# EAGLE design Expansion board rev1 (EAGLE 7.6.0)
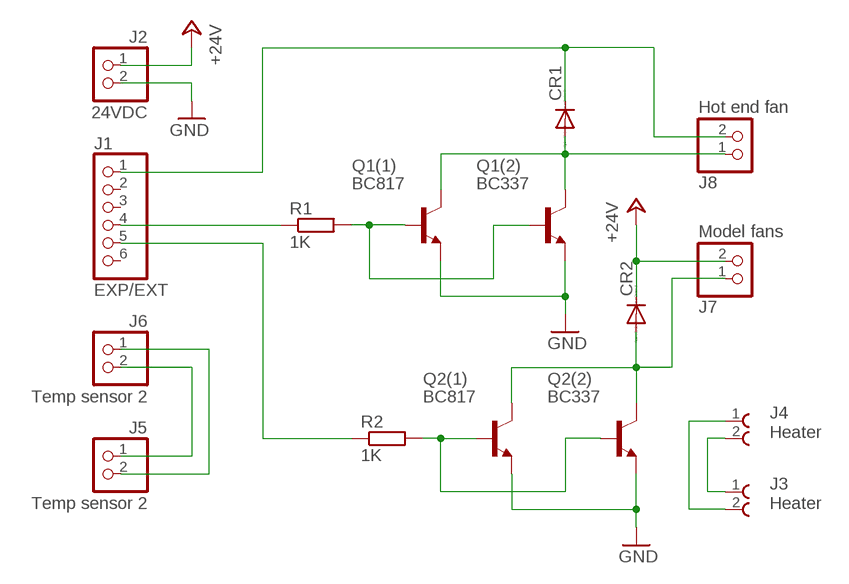
[diagram p0: schematic, sheet 1]

## Parts
CR1  TESTDIODE  [DO214AC]
CR2  TESTDIODE  [DO214AC]
J1  EXP/EXT  PINHD-2X3  [2X03]
J2  24VDC  PINHD-1X2  [1X02]
J3  Heater  691216710002  [691216710002]
J4  Heater  691216710002  [691216710002]
J5  Temp sensor 2  PINHD-1X2  [1X02]
J6  Temp sensor 2  PINHD-1X2  [1X02]
J7  Model fans  PINHD-1X2  [1X02]
J8  Hot end fan  S2B-XH-A  [JST_XH_2_RA]
Q1(1)  BC817  BC817-40SMD  [SOT23-BEC]
Q1(2)  BC337  BC337-40  [TO92]
Q2(1)  BC817  BC817-40SMD  [SOT23-BEC]
Q2(2)  BC337  BC337-40  [TO92]
R1  1K  R-EU_M3216  [M3216]
R2  1K  R-EU_M3216  [M3216]

## Nets
+24V: CR2.C J2.1 J7.2
GND: J2.2 Q1(1).E Q1(2).1(E) Q2(1).E Q2(2).1(E)
N$1: CR2.A J7.1 Q2(1).C Q2(2).3(C)
N$2: J3.2 J4.1
N$3: CR1.A J8.1 Q1(1).C Q1(2).3(C)
N$4: J3.1 J4.2
N$5: Q2(1).B Q2(2).2(B) R2.2
N$6: Q1(1).B Q1(2).2(B) R1.2
N$7: CR1.C J1.1 J8.2
N$8: J1.5 R2.1
N$9: J1.4 R1.1
N$20: J5.1 J6.2
N$21: J5.2 J6.1
Unconnected: J1.2 J1.3 J1.6

## Library data of the parts
CR1 CR2 = [ME] Semiconductors:TESTDIODE
J1 = [ME] Connectors:PINHD-2X3: PIN HEADER
J2 J5-J7 = pinhead:PINHD-1X2: PIN HEADER
J3 J4 = Wurth_EAGLE-TERMINAL_BLOCKS-rev16e:691216710002: WR-TBL2 SERIE 2167 - 5.00 MM - HORIZONTAL CABLE ENTRY WITH RISING CAGE CLAMP - 2 pins <http://katalog.we-online.de/media/images/eican/Con_TBL_Screw_RisingClamp_5.00_6912167100xx_pf2.jpg> Details see: http://katalog.we-online.de/en/em/TBL_5_00_2167_HORIZONTAL_ENTRY_W_RISING_CAGE_69121671000x Created on 2015-07-10 2015 (C) Wurth Elektronik
J8 = [ME] Connectors:S2B-XH-A
Q1(1) Q2(1) = transistor-npn:BC817*: NPN Transistor
Q1(2) Q2(2) = transistor-npn:BC337*: NPN Transistor
R1 R2 = resistor:R-EU_: RESISTOR, European symbol

## Board
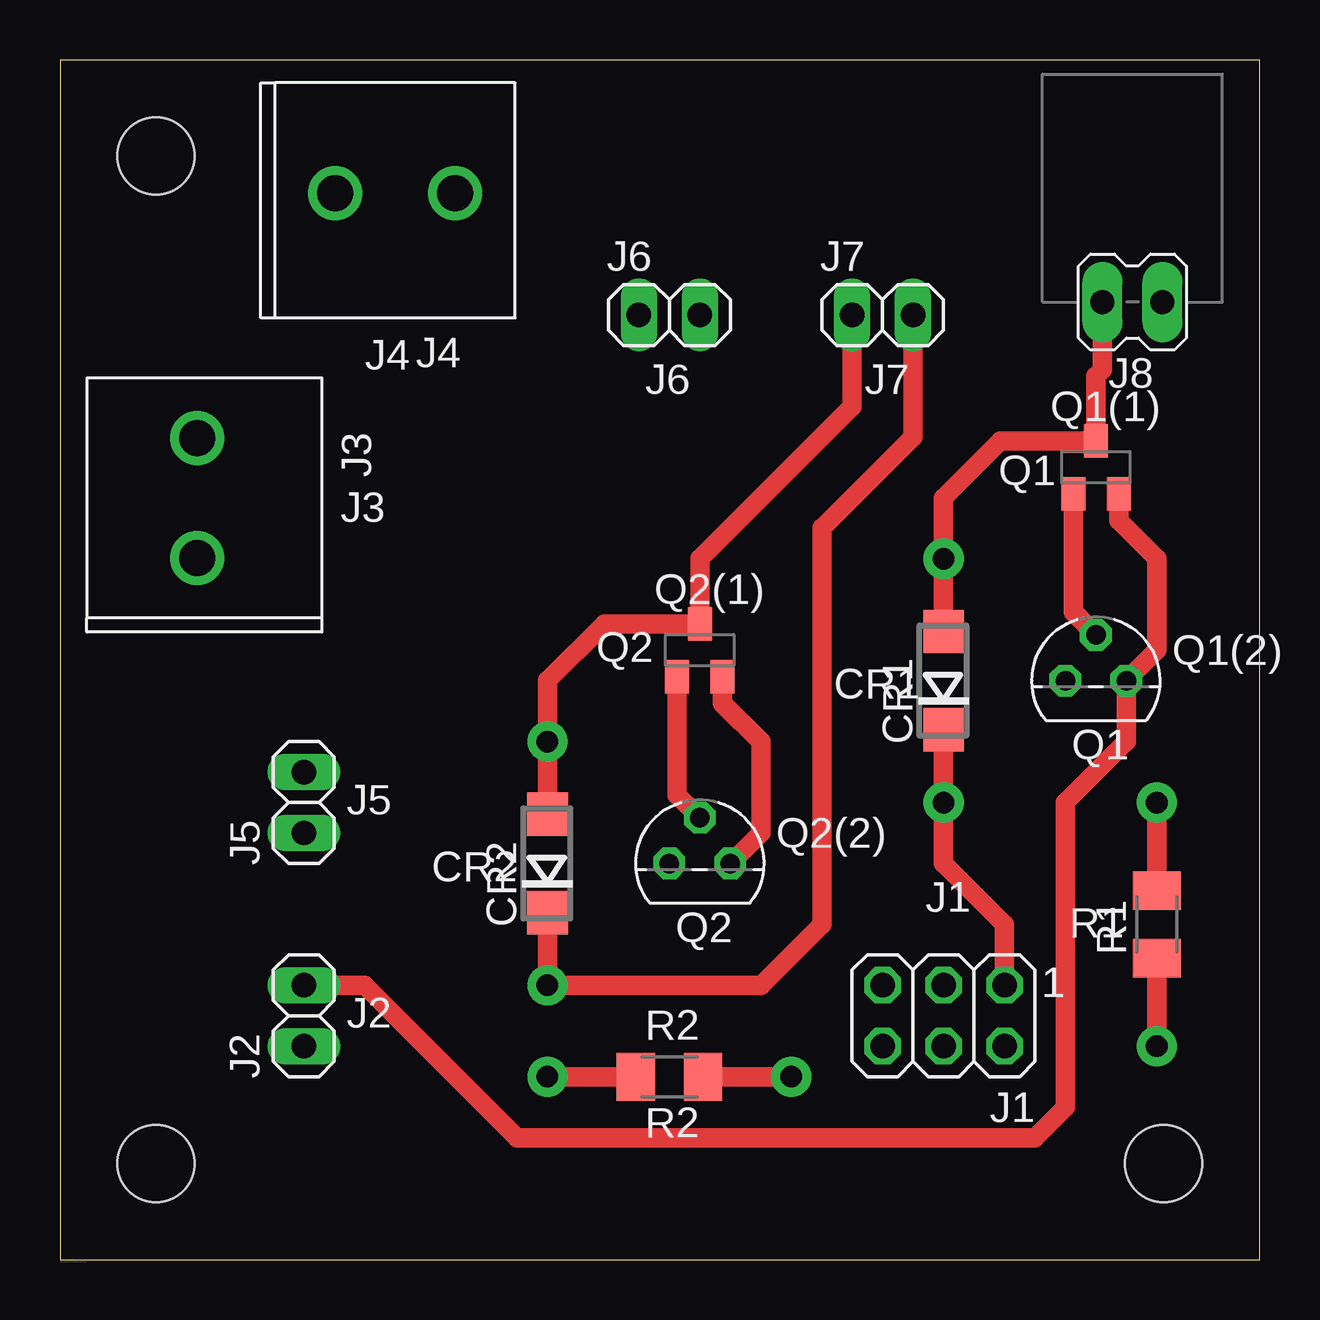
[diagram p1: board, top side]
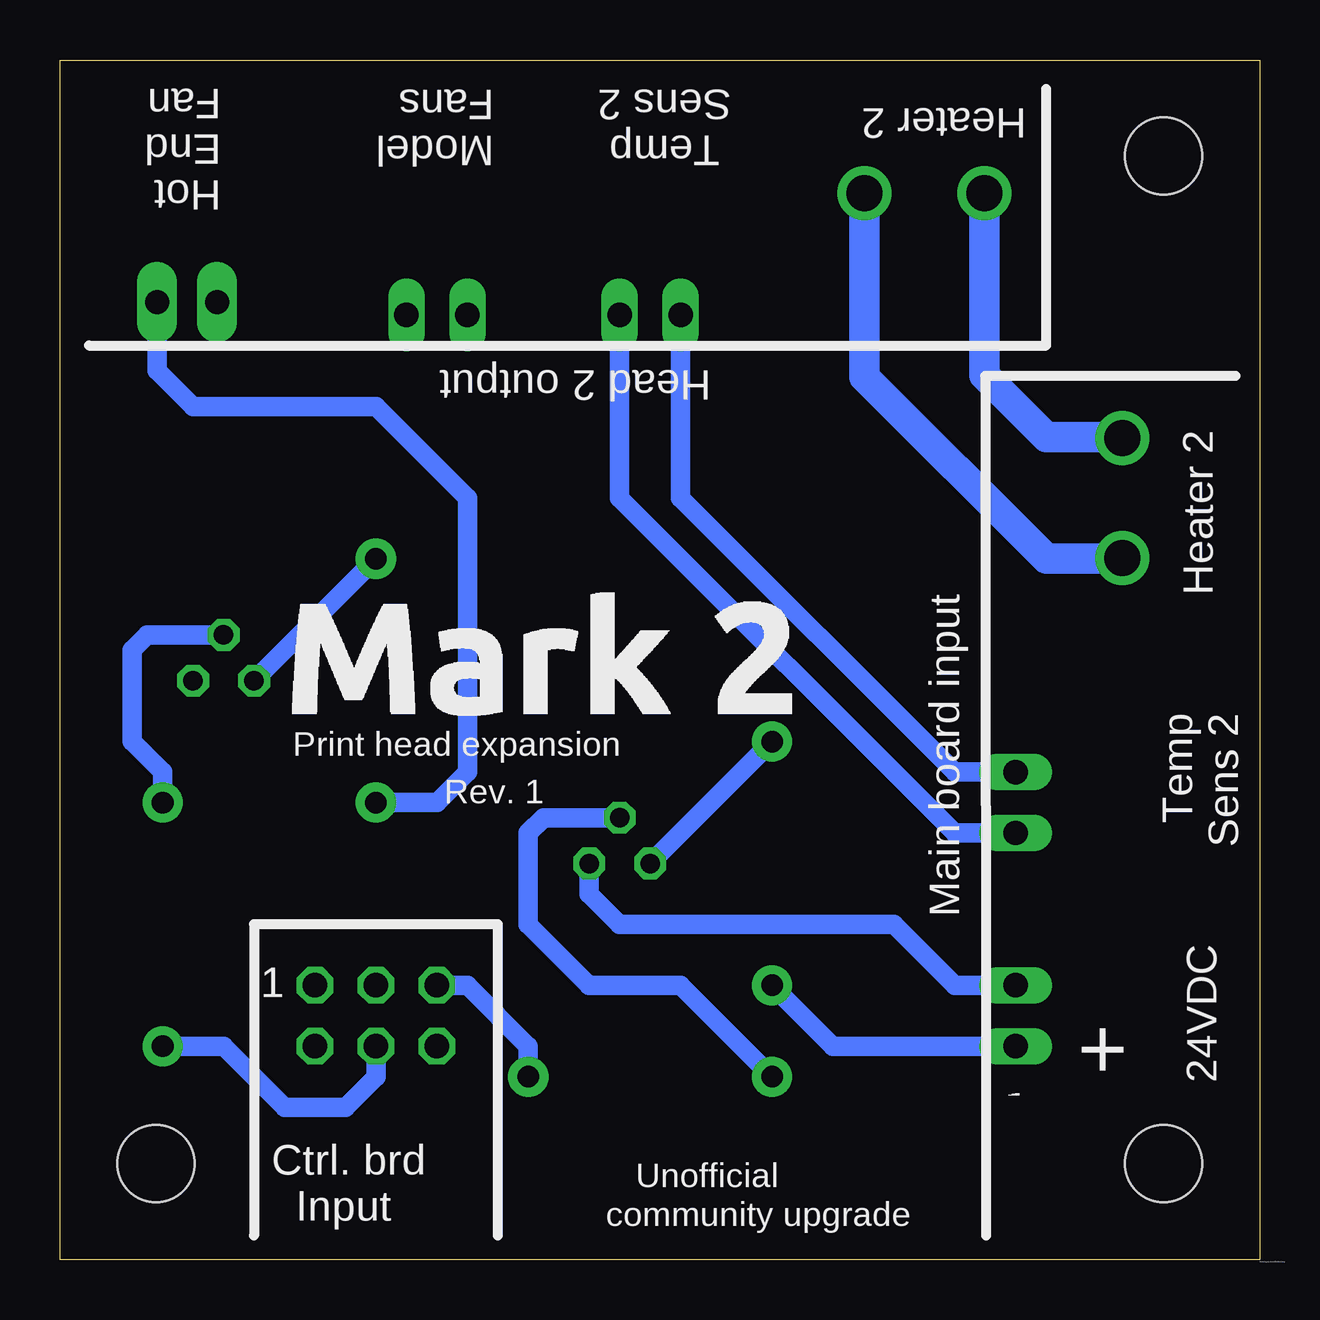
[diagram p2: board, bottom side, seen from below]

Size 50 x 50 mm. Coordinates in mm from the lower left corner, seen from the top.
Outline: 0,0 50,0 50,50 0,50 0,0
Copper layers (1*16): Top 0.035mm / dielectric 1.5mm / Bottom 0.035mm
Design rules "ITEADstudio_DRC": minimum track width 6mil, minimum drill 12mil, track to track 6mil, track to pad 6mil, pad to pad 6mil, via to via 6mil, smd to smd 0mil, copper to edge 10mil, drill to drill 10mil, minimum pad ring 10mil, minimum via ring 6mil, stop-mask expansion 2mil, vias tented up to drill 100mil, thermal gap 10mil
Holes 3.2 mm at 4,4 46,4 4,46

### Footprints (pad centres in the part's own frame; a part is rotated, then mirrored left to right if it is on the bottom)
DO214AC = smd 1.8 x 1.7: A 2.05,0; C -2.05,0
2X03 = drill 1.016 octagon: 1 -2.54,-1.27; 2 -2.54,1.27; 3 0,-1.27; 4 0,1.27; 5 2.54,-1.27; 6 2.54,1.27
1X02 = drill 1.016 long: 1 -1.27,0; 2 1.27,0
691216710002 = drill 1.5: 1 -2.5,0; 2 2.5,0
JST_XH_2_RA = drill 1 pad 1.676 long: 1 -1,-2; 2 1.5,-2
SOT23-BEC = smd 1 x 1.4: B -0.95,-1.1; C 0,1.1; E 0.95,-1.1
TO92 = drill 0.813 octagon: 1 1.27,0; 2 0,1.905; 3 -1.27,0
M3216 = smd 1.6 x 2: 1 -1.4,0; 2 1.4,0

### Placement (x,y rotation side)
CR1  36.83,24.13 90 top
CR2  20.32,16.51 90 top
J1  36.83,10.16 180 top
J2  10.16,10.16 90 top
J3  5.71,31.75 270 top
J4  13.97,44.45 180 top
J5  10.16,19.05 90 top
J6  25.4,39.37 0 top
J7  34.29,39.37 0 top
J8  44.45,41.91 0 top
Q1(1)  43.18,33.02 0 top
Q1(2)  43.18,24.13 0 top
Q2(1)  26.67,25.4 0 top
Q2(2)  26.67,16.51 0 top
R1  45.72,13.97 90 top
R2  25.4,7.62 180 top

### Tracks (layer width: path | path; a pad name or v marks a point on that pad's centre or on a via)
+24V  (via drill 0.9 pad 1.68)
  Top 0.813: J7.2 35.56,34.29 31.75,30.48 31.75,13.97 29.21,11.43 v20.32,11.43 CR2.C
  Bottom 0.813: J2.1 17.78,8.89 v20.32,11.43
GND
  Top 0.813: Q1(1).E 44.13,30.8 45.72,29.21 45.72,25.4 Q1(2).1 44.45,21.59 41.91,19.05 41.91,6.35 40.64,5.08 19.05,5.08 12.7,11.43 J2.2 | Q2(1).E 27.62,23.18 29.21,21.59 29.21,17.78 Q2(2).1
  Bottom 0.813: Q2(2).1 27.94,15.24 26.67,13.97 15.24,13.97 12.7,11.43 J2.2
N$1  (via drill 0.9 pad 1.68)
  Top 0.813: J7.1 33.02,35.56 26.67,29.21 Q2(1).C 22.69,26.5 20.32,24.13 v20.32,21.59 CR2.A
  Bottom 0.813: Q2(2).3 v20.32,21.59
N$2
  Bottom 1.27: J4.1 16.47,36.79 8.89,29.21 5.75,29.21 J3.2
N$3  (via drill 0.9 pad 1.68)
  Top 0.813: CR1.A v36.83,29.21 36.83,31.75 39.2,34.12 Q1(1).C 43.18,36.83 43.45,37.1 J8.1
  Bottom 0.813: v36.83,29.21 Q1(2).3
N$4
  Bottom 1.27: J4.2 11.47,36.87 8.89,34.29 5.75,34.29 J3.1
N$5  (via drill 0.9 pad 1.68)
  Top 0.813: Q2(1).B 25.72,19.36 Q2(2).2 | v20.32,7.62 R2.2
  Bottom 0.813: Q2(2).2 29.84,18.41 30.48,17.78 30.48,13.97 27.94,11.43 24.13,11.43 v20.32,7.62
N$6  (via drill 0.9 pad 1.68)
  Top 0.813: Q1(1).B 42.23,26.98 Q1(2).2 | R1.2 v45.72,19.05
  Bottom 0.813: v45.72,19.05 45.72,20.32 46.99,21.59 46.99,25.4 46.35,26.04 Q1(2).2
N$7  (via drill 0.9 pad 1.68)
  Top 0.813: CR1.C v36.83,19.05 36.83,16.51 39.37,13.97 J1.1
  Bottom 0.813: v36.83,19.05 34.29,19.05 33.02,20.32 33.02,31.75 36.83,35.56 44.45,35.56 45.95,37.06 J8.2
N$8  (via drill 0.9 pad 1.68)
  Top 0.813: R2.1 v30.48,7.62
  Bottom 0.813: v30.48,7.62 30.48,8.89 33.02,11.43 J1.5
N$9  (via drill 0.9 pad 1.68)
  Top 0.813: R1.1 v45.72,8.89
  Bottom 0.813: v45.72,8.89 43.18,8.89 40.64,6.35 38.1,6.35 36.83,7.62 J1.4
N$20
  Bottom 0.813: J6.2 26.67,31.75 12.7,17.78 J5.1
N$21
  Bottom 0.813: J5.2 12.7,20.32 24.13,31.75 J6.1

### Text on the board
tPlace: J4 | J6 | J7 | J8 | Q1 | J3 | Q2 | CR1 | Q1 | J5 | CR2 | J1 | Q2 | R1 | 1 | J2 | R2 | /home/syntaxterror/Untitled2.bmp
bPlace: Temp / Sens 2 | Model / Fans | Hot / End / Fan | Heater 2 | Head 2 output | Heater 2 | Main board input | Temp / Sens 2 | Print head expansion | Rev. 1 | 24VDC | 1 | + | Unofficial | community upgrade | Ctrl. brd / Input | /home/syntaxterror/Untitled.bmp | /home/syntaxterror/Untitled.bmp
tOrigins: /home/syntaxterror/Untitled.bmp